# EAGLE design c12666afe (EAGLE 7.6.0)
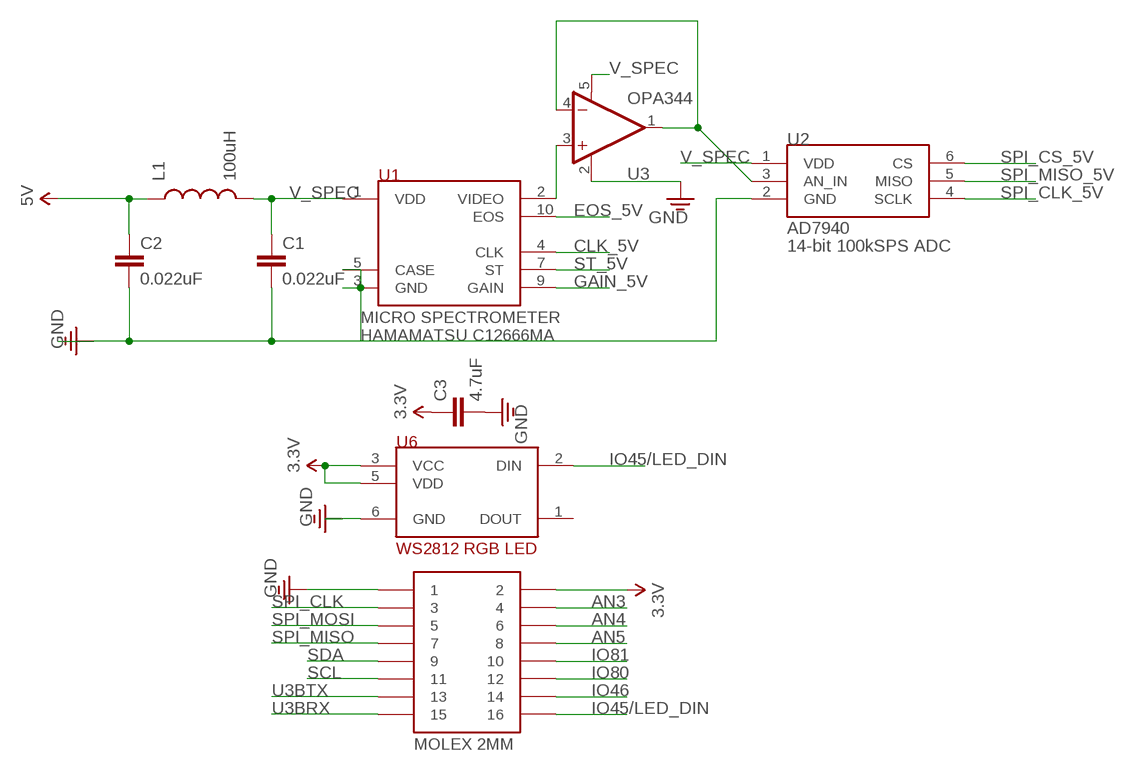
[diagram p0: schematic, sheet 1]

## Parts
2MMCONNECTOR  CON-MOLEX-2MMMALE  [MOLEX-0877591650]
C1  0.022uF  CAP0603  [0603]
C2  0.022uF  CAP0603  [0603]
C3  4.7uF  CAP0603  [0603]
L1  100uH  INDUCTOR0805  [0805]
U1  MICROSPEC-C12666MA  [C12666MA]
U2  AD7940  [SOT-23-6L]
U3  OPA344  [SOT23-5]
U6  WS2812_NEOPIXEL  [WS2812]

## Nets
3.3V: 2MMCONNECTOR.2 C3.1 U6.3(VCC) U6.5(VDD)
5V: C2.1 L1.1
AN3: 2MMCONNECTOR.4
AN4: 2MMCONNECTOR.6
AN5: 2MMCONNECTOR.8
CLK_5V: U1.4(CLK)
EOS_5V: U1.10(EOS)
GAIN_5V: U1.9(GAIN)
GND: 2MMCONNECTOR.1 C1.2 C2.2 C3.2 U1.3(GND) U1.5(CASE) U2.2(GND) U3.2(V-) U6.6(GND)
IO45/LED_DIN: 2MMCONNECTOR.16 U6.2(DIN)
IO46: 2MMCONNECTOR.14
IO80: 2MMCONNECTOR.12
IO81: 2MMCONNECTOR.10
N$1: U2.3(AN_IN) U3.1(OUT) U3.4(-IN)
N$2: U1.2(VIDEO) U3.3(+IN)
SCL: 2MMCONNECTOR.11
SDA: 2MMCONNECTOR.9
SPI_CLK: 2MMCONNECTOR.3
SPI_CLK_5V: U2.4(SCLK)
SPI_CS_5V: U2.6(CS)
SPI_MISO: 2MMCONNECTOR.7
SPI_MISO_5V: U2.5(MISO)
SPI_MOSI: 2MMCONNECTOR.5
ST_5V: U1.7(ST)
U3BRX: 2MMCONNECTOR.15
U3BTX: 2MMCONNECTOR.13
V_SPEC: C1.1 L1.2 U1.1(VDD) U2.1(VDD) U3.5(V+)
Unconnected: U6.1(DOUT)

## Library data of the parts
2MMCONNECTOR = notes-arducorder-mini:CON-MOLEX-2MM: Molex 2mm pitch connectors. (87368-1624, 0877591650)
C1 C2 = notes_mark5:CAP: Capacitor Standard 0603 ceramic capacitor, and 0.1" leaded capacitor.
C3 = notes_mark5a:CAP: Capacitor Standard 0603 ceramic capacitor, and 0.1" leaded capacitor.
L1 = SparkFun-Passives:INDUCTOR: Inductors Basic Inductor/Choke - 0603 and 1206. Footprints are not proven and vary greatly between part numbers.
U1 = arducorder-mini:MICROSPEC-C12666MA: Hamamatsu Micro-Spectrometer C12666MA 350-750nm
U2 = notes_mark5:AD7940: Analog Devices AD7940 14-bit ADC, 100k Samples/sec sample rate, 2.5-5V single supply
U3 = SparkFun-AnalogIC:OPA344: Single gate rail-to-rail output op-amp. Inputs extend 300mV past rails.
U6 = notes_mark5a:WS2812_NEOPIXEL: WS2812 "Neopixel" RGB LED w/digital interface

## Net classes
1 supply: width 0.178 mm
3 usbvcc: width 0.61 mm, drill 0.508 mm, clearance 0.203 mm to class 0, clearance 0.254 mm
5 USB: width 0.14 mm

## Board
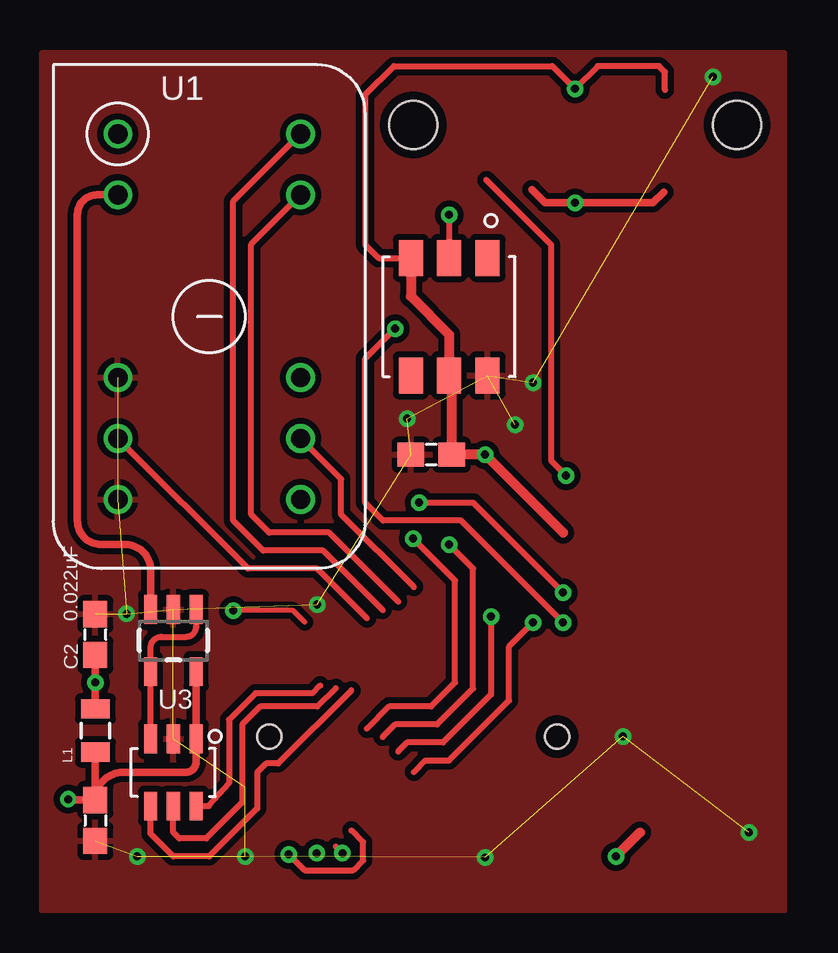
[diagram p1: board, top side]
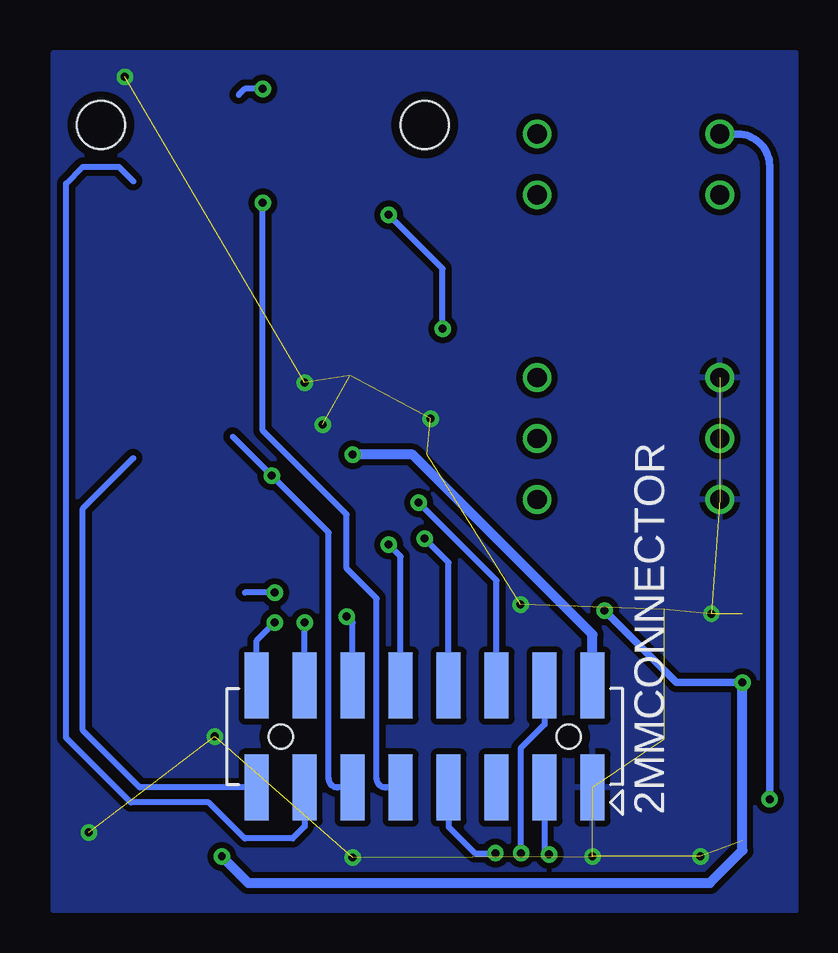
[diagram p2: board, bottom side, seen from below]

No outline drawn. Coordinates in mm, seen from the top.
Copper layers (1*16): Top 0.0356mm / dielectric 1.5011mm / Bottom 0.0356mm
Design rules "default *": minimum track width 6mil, minimum drill 13mil, track to track 10mil, track to pad 7mil, pad to pad 7mil, via to via 7mil, smd to smd 7mil, copper to edge 15mil, drill to drill 6mil, minimum pad ring 7mil, minimum via ring 7mil, stop-mask expansion 3mil, vias tented up to drill 0mil, thermal gap 10mil
Holes 2 mm at 38.5,39 25,39

### Footprints (pad centres in the part's own frame; a part is rotated, then mirrored left to right if it is on the bottom)
MOLEX-0877591650 = smd 1 x 2.75: 1 7,-2.125; 2 7,2.125; 3 5,-2.125; 4 5,2.125; 5 3,-2.125; 6 3,2.125; 7 1,-2.125; 8 1,2.125; 9 -1,-2.125; 10 -1,2.125; 11 -3,-2.125; 12 -3,2.125; 13 -5,-2.125; 14 -5,2.125; 15 -7,-2.125; 16 -7,2.125 | hole 1: -6,0; 6,0
0603 = smd 1.1 x 1: 1 -0.85,0; 2 0.85,0
0805 = smd 0.8 x 1.2: 1 -0.9,0; 2 0.9,0
C12666MA = drill 0.8: 1 -7.62,-3.81; 2 -5.08,-3.81; 3 2.54,-3.81; 4 5.08,-3.81; 5 7.62,-3.81; 6 7.62,3.81; 7 5.08,3.81; 8 2.54,3.81; 9 -5.08,3.81; 10 -7.62,3.81
SOT-23-6L = smd 0.55 x 1.2: 1 -0.95,-1.4; 2 0,-1.4; 3 0.95,-1.4; 4 0.95,1.4; 5 0,1.4; 6 -0.95,1.4
SOT23-5 = smd 0.55 x 1.2: 1 -0.95,-1.3; 2 0,-1.3; 3 0.95,-1.3; 4 0.95,1.3; 5 -0.95,1.3
WS2812 = smd 1.5 x 1: 1 2.45,-1.6; 2 2.45,0; 3 2.45,1.6; 4 -2.45,1.6; 5 -2.45,0; 6 -2.45,-1.6

### Placement (x,y rotation side)
2MMCONNECTOR  25,13.5 0 bottom
C1  11.75,10 270 top
C2  11.75,17.75 90 top
C3  25.75,25.25 180 top
L1  11.75,13.75 270 top
U1  16.5,31 270 top
U2  15,12 180 top
U3  15,17.5 180 top
U6  26.5,31 90 top

### Tracks (layer width: path | path; a pad name or v marks a point on that pad's centre or on a via)
3.3V  (via drill 0.33)
  Top 0.254: 35.5,40.46 35.5,41.2 35.25,41.45 32.7,41.45 v31.75,40.5 | 31.73,40.52 v31.75,40.5 | U6.3 23.55,33.45 23,34 23,40.25 24.2,41.45 30.8,41.45 v31.75,40.5
  Top 0.406: U6.3 24.9,31.85 26.5,30.25 U6.5 26.6,28.45 C3.1 v28,25.25 31.25,22
  Bottom 0.254: v31.75,40.5 32.5,40.5 32.75,40.25
  Bottom 0.406: 2MMCONNECTOR.2 18,17.75 25.5,25.25 v28,25.25
5V  (via drill 0.33)
  Top 0.203: 20.48,18.27 20,18.75 v17.5,18.75
  Top 0.305: C2.1 v11.75,15.75 L1.1
  Top 0.406: 34.45,9.5 v33.45,8.5
  Bottom 0.305: v17.5,18.75 14.5,15.75 v11.75,15.75
  Bottom 0.406: v33.45,8.5 32.35,7.4 13.1,7.4 11.75,8.75 v11.75,15.75
AN3  (via drill 0.33)
  Top 0.254: 21.12,8.78 v20.98,8.64
  Bottom 0.254: 2MMCONNECTOR.4 20,14 21,13 21,8.66 v20.98,8.64
AN4  (via drill 0.33)
  Top 0.254: v25.25,23.25 27.51,23.25 27.51,23.24 v31.25,19.5
  Bottom 0.254: 2MMCONNECTOR.6 22,20 v25.25,23.25 | v31.25,19.5 32.5,19.5
AN5  (via drill 0.33)
  Top 0.254: 23.07,13.82 24,14.75 25.75,14.75 26.75,15.75 26.75,20 v25,21.75
  Bottom 0.254: 2MMCONNECTOR.8 24,20.75 v25,21.75
CLK_5V
  Top 0.254: 23.07,18.43 21,20.5 18.11,20.5 U1.4
EOS_5V
  Top 0.254: 23.73,18.77 21.25,21.25 18.75,21.25 17.5,22.5 17.5,35.81 U1.10
GAIN_5V
  Top 0.254: 24.38,19.12 21.5,22 19,22 18.25,22.75 18.25,34.02 U1.9
GND  (via drill 0.33)  (19 unrouted)
  other vias: 13.05,18.61 30,28.25 13.5,8.5 28,8.45 39,9.5 37.5,41 21,19 29.25,26.5 24.75,26.75 18,8.5 33.75,13.5
  pour Top: 9.5,42 9.5,6.25 40.5,6.25 40.5,42
  pour Bottom: 9.5,6.25 9.5,42 40.5,42 40.5,6.25
IO45/LED_DIN  (via drill 0.33)
  Top 0.254: v24.25,30.5 23,29.25 23,23.25 23.75,22.5 27,22.5 v31.25,18.25 | v26.5,35.25 U6.2
  Bottom 0.254: 2MMCONNECTOR.16 32,17.5 v31.25,18.25 | v24.25,30.5 24.25,33 v26.5,35.25
IO46  (via drill 0.33)
  Top 0.254: 25.02,12.03 25.5,12.5 26.5,12.5 29,15 29,17.25 v30,18.25
  Bottom 0.254: 2MMCONNECTOR.14 v30,18.25
IO80  (via drill 0.33)
  Top 0.254: v28.25,18.5 28.25,15.25 26.25,13.25 24.75,13.25 24.38,12.88
  Bottom 0.254: 2MMCONNECTOR.12 28,18.25 v28.25,18.5
IO81  (via drill 0.33)
  Top 0.254: 23.73,13.47 24.25,14 26,14 27.5,15.5 27.5,20.5 v26.5,21.5
  Bottom 0.254: 2MMCONNECTOR.10 26,21 v26.5,21.5
N$1
  Top 0.254: U2.3 U3.4 14.05,17.2 arc-90 14.5,17.65 15.55,17.65 arc90 15.95,18.1 U3.1
N$2
  Top 0.305: U1.2 11.83,36.08 arc90 11,35.25 11,22.5 arc90 12,21.5 13,21.5 arc-90 14.05,20.45 U3.3
SCL  (via drill 0.33)
  Top 0.254: 28.05,36.7 30.75,34 30.75,25 v31.38,24.38
  Bottom 0.254: 2MMCONNECTOR.11 28.62,11.38 arc90 29,11.75 29,22 v31.38,24.38 33,26
SDA  (via drill 0.33)
  Top 0.305: 29.95,36.3 30.5,35.75 v31.75,35.75 35,35.75 35.45,36.2
  Bottom 0.254: 2MMCONNECTOR.9 26.62,11.38 arc90 27,11.75 27,19.25 28.25,20.5 28.25,22.75 31.75,26.25 v31.75,35.75
SPI_CLK  (via drill 0.33)
  Top 0.254: v19.81,8.59 20.47,7.92 22.5,7.92 22.91,8.33 22.91,9.09 22.43,9.58
  Bottom 0.254: 2MMCONNECTOR.3 20,8.77 v19.81,8.59
SPI_CLK_5V
  Top 0.254: 22.43,15.43 19.38,12.38 18.88,12.38 18.5,12 18.5,10.5 16.5,8.5 15,8.5 14.05,9.45 U2.4
SPI_CS_5V
  Top 0.254: 21.12,15.62 20.8,15.3 18.43,15.3 17.32,14.2 17.32,11.55 16.48,10.6 U2.6
SPI_MISO  (via drill 0.33)
  Top 0.254: v22.05,8.64 21.77,8.91
  Bottom 0.254: 2MMCONNECTOR.7 24,9.72 22.91,8.64 v22.05,8.64
SPI_MISO_5V
  Top 0.254: 21.77,15.53 21,14.75 18.62,14.75 17.88,14 17.88,10.75 16.38,9.25 15.25,9.25 15,9.5 U2.5
ST_5V
  Top 0.254: 25.02,19.73 22,22.75 22,24.23 U1.7
U3BRX
  Bottom 0.254: 2MMCONNECTOR.15 36.88,11.38 39.25,13.75 39.25,23 37.15,25.1
U3BTX
  Bottom 0.254: 2MMCONNECTOR.13 30,9.75 30.5,9.25 32.5,9.25 34,10.75 37.25,10.75 39.95,13.45 39.95,36.55 39.25,37.25 37.75,37.25 37.15,36.65
V_SPEC  (via drill 0.33)
  Top 0.305: C1.1 L1.2 | U3.5 U2.1 15.95,12.45 arc-90 15.5,12 12.9,12 arc90 C1.1 | C1.1 10.65,10.85 v10.62,10.89
  Bottom 0.305: v10.62,10.89 10.62,37.29 arc-90 11.94,38.61 12.68,38.61 arc90 U1.1